# Altium schematic sheet Ribbon_Connectors.SchDoc
size Letter
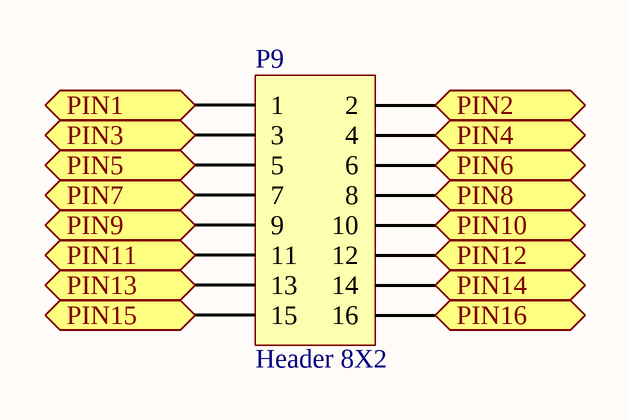
[diagram p0: Ribbon_Connectors.SchDoc]

## Parts
P9  Header 8X2  [HDR2X8]

## Ports
PIN1, PIN2, PIN3, PIN4, PIN5, PIN6, PIN7, PIN8, PIN9, PIN10, PIN11, PIN12, PIN13, PIN14, PIN15, PIN16

## Nets
PIN1: P9.1 ; port PIN1
PIN2: P9.2 ; port PIN2
PIN3: P9.3 ; port PIN3
PIN4: P9.4 ; port PIN4
PIN5: P9.5 ; port PIN5
PIN6: P9.6 ; port PIN6
PIN7: P9.7 ; port PIN7
PIN8: P9.8 ; port PIN8
PIN9: P9.9 ; port PIN9
PIN10: P9.10 ; port PIN10
PIN11: P9.11 ; port PIN11
PIN12: P9.12 ; port PIN12
PIN13: P9.13 ; port PIN13
PIN14: P9.14 ; port PIN14
PIN15: P9.15 ; port PIN15
PIN16: P9.16 ; port PIN16

## Library data of the parts
P9 = Header 8X2: Header, 8-Pin, Dual row; LatestRevisionDate: 17-Jul-2002; LatestRevisionNote: Re-released for DXP Platform.; Publisher: Altium Limited